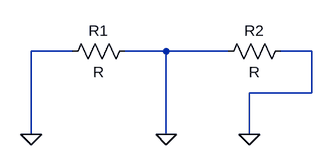
[diagram p0: schematic Draft1.asc]
Draft1.asc, the LTspice schematic file:
Version 4
SHEET 1 880 680
WIRE 32 128 -32 128
WIRE 176 128 112 128
WIRE 272 128 176 128
WIRE 400 128 352 128
WIRE 400 192 400 128
WIRE 400 192 304 192
WIRE -32 256 -32 128
WIRE 176 256 176 128
WIRE 304 256 304 192
FLAG 176 256 0
FLAG -32 256 0
FLAG 304 256 0
SYMBOL res 128 112 R90
WINDOW 0 0 56 VBottom 2
WINDOW 3 32 56 VTop 2
SYMATTR InstName R1
SYMBOL res 368 112 R90
WINDOW 0 0 56 VBottom 2
WINDOW 3 32 56 VTop 2
SYMATTR InstName R2

The netlist it stands for:
* Draft1.asc
R1 0 0 R
R2 0 0 R
.backanno
.end